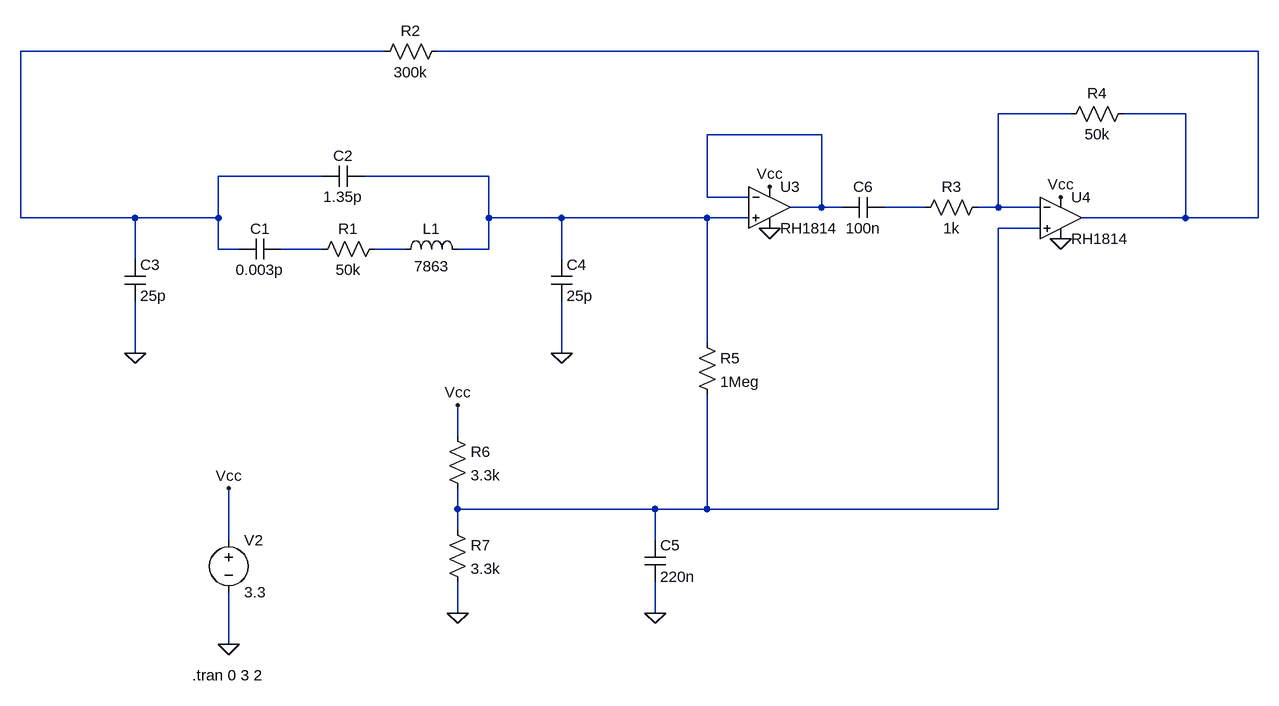
[diagram p0: schematic Pierce_OPAMP.asc]
Pierce_OPAMP.asc, the LTspice schematic file:
Version 4
SHEET 1 1748 880
WIRE 224 -96 -336 -96
WIRE 1568 -96 304 -96
WIRE 1280 0 1168 0
WIRE 1456 0 1360 0
WIRE 896 32 720 32
WIRE 128 96 -32 96
WIRE 384 96 192 96
WIRE 720 128 720 32
WIRE 784 128 720 128
WIRE 896 144 896 32
WIRE 896 144 848 144
WIRE 928 144 896 144
WIRE 1056 144 992 144
WIRE 1168 144 1168 0
WIRE 1168 144 1136 144
WIRE 1232 144 1168 144
WIRE -336 160 -336 -96
WIRE -160 160 -336 160
WIRE -32 160 -32 96
WIRE -32 160 -160 160
WIRE 384 160 384 96
WIRE 496 160 384 160
WIRE 720 160 496 160
WIRE 784 160 720 160
WIRE 1456 160 1456 0
WIRE 1456 160 1296 160
WIRE 1568 160 1568 -96
WIRE 1568 160 1456 160
WIRE 1232 176 1168 176
WIRE -32 208 -32 160
WIRE 0 208 -32 208
WIRE 128 208 64 208
WIRE 256 208 208 208
WIRE 384 208 384 160
WIRE 384 208 336 208
WIRE -160 224 -160 160
WIRE 496 224 496 160
WIRE 720 352 720 160
WIRE -160 368 -160 288
WIRE 496 368 496 288
WIRE 336 496 336 448
WIRE 336 608 336 576
WIRE 640 608 336 608
WIRE 720 608 720 432
WIRE 720 608 640 608
WIRE 1168 608 1168 176
WIRE 1168 608 720 608
WIRE 336 640 336 608
WIRE -16 656 -16 576
WIRE 640 656 640 608
WIRE 336 768 336 720
WIRE 640 768 640 720
WIRE -16 816 -16 736
FLAG 1264 192 0
FLAG 1264 128 Vcc
FLAG -16 816 0
FLAG -16 576 Vcc
FLAG 336 448 Vcc
FLAG 336 768 0
FLAG 640 768 0
FLAG 496 368 0
FLAG -160 368 0
FLAG 816 176 0
FLAG 816 112 Vcc
SYMBOL res 112 224 R270
WINDOW 0 32 56 VTop 2
WINDOW 3 0 56 VBottom 2
SYMATTR InstName R1
SYMATTR Value 50k
SYMBOL ind 240 224 R270
WINDOW 0 32 56 VTop 2
WINDOW 3 5 56 VBottom 2
SYMATTR InstName L1
SYMATTR Value 7863
SYMBOL cap 0 224 R270
WINDOW 0 32 32 VTop 2
WINDOW 3 0 32 VBottom 2
SYMATTR InstName C1
SYMATTR Value 0.003p
SYMBOL cap 128 112 R270
WINDOW 0 32 32 VTop 2
WINDOW 3 0 32 VBottom 2
SYMATTR InstName C2
SYMATTR Value 1.35p
SYMBOL res 208 -80 R270
WINDOW 0 32 56 VTop 2
WINDOW 3 0 56 VBottom 2
SYMATTR InstName R2
SYMATTR Value 300k
SYMBOL res 1040 160 R270
WINDOW 0 32 56 VTop 2
WINDOW 3 0 56 VBottom 2
SYMATTR InstName R3
SYMATTR Value 1k
SYMBOL res 1264 16 R270
WINDOW 0 32 56 VTop 2
WINDOW 3 0 56 VBottom 2
SYMATTR InstName R4
SYMATTR Value 50k
SYMBOL res 704 336 R0
SYMATTR InstName R5
SYMATTR Value 1Meg
SYMBOL voltage -16 640 R0
WINDOW 123 0 0 Left 2
WINDOW 39 0 0 Left 2
SYMATTR InstName V2
SYMATTR Value 3.3
SYMBOL res 320 480 R0
SYMATTR InstName R6
SYMATTR Value 3.3k
SYMBOL res 320 624 R0
SYMATTR InstName R7
SYMATTR Value 3.3k
SYMBOL cap 624 656 R0
SYMATTR InstName C5
SYMATTR Value 220n
SYMATTR SpiceLine Rser=2
SYMBOL cap 928 160 R270
WINDOW 0 32 32 VTop 2
WINDOW 3 0 32 VBottom 2
SYMATTR InstName C6
SYMATTR Value 100n
SYMBOL cap 480 224 R0
SYMATTR InstName C4
SYMATTR Value 25p
SYMBOL cap -176 224 R0
SYMATTR InstName C3
SYMATTR Value 25p
SYMBOL OpAmps\\RH1814 816 144 R0
SYMATTR InstName U3
SYMBOL OpAmps\\RH1814 1264 160 R0
SYMATTR InstName U4
TEXT -72 864 Left 2 !.tran 0 3 2

The netlist it stands for:
* Pierce_OPAMP.asc
R1 N008 N009 50k
L1 N009 N005 7863
C1 N001 N008 0.003p
C2 N001 N005 1.35p
R2 N001 N002 300k
R3 N006 N003 1k
R4 N003 N002 50k
R5 N005 N007 1Meg
V2 Vcc 0 3.3
R6 Vcc N007 3.3k
R7 N007 0 3.3k
C5 N007 0 220n Rser=2
C6 N004 N006 100n
C4 N005 0 25p
C3 N001 0 25p
* U3: RH1814 (symbol OpAmps\RH1814 not available, pins judged from their places): In+=N005 In-=N004 V+=Vcc V-=0 OUT=N004
* U4: RH1814 (symbol OpAmps\RH1814 not available, pins judged from their places): In+=N007 In-=N003 V+=Vcc V-=0 OUT=N002
.tran 0 3 2
.backanno
.end